# EAGLE design FLYTE-v2_1 (EAGLE 9.6.2)
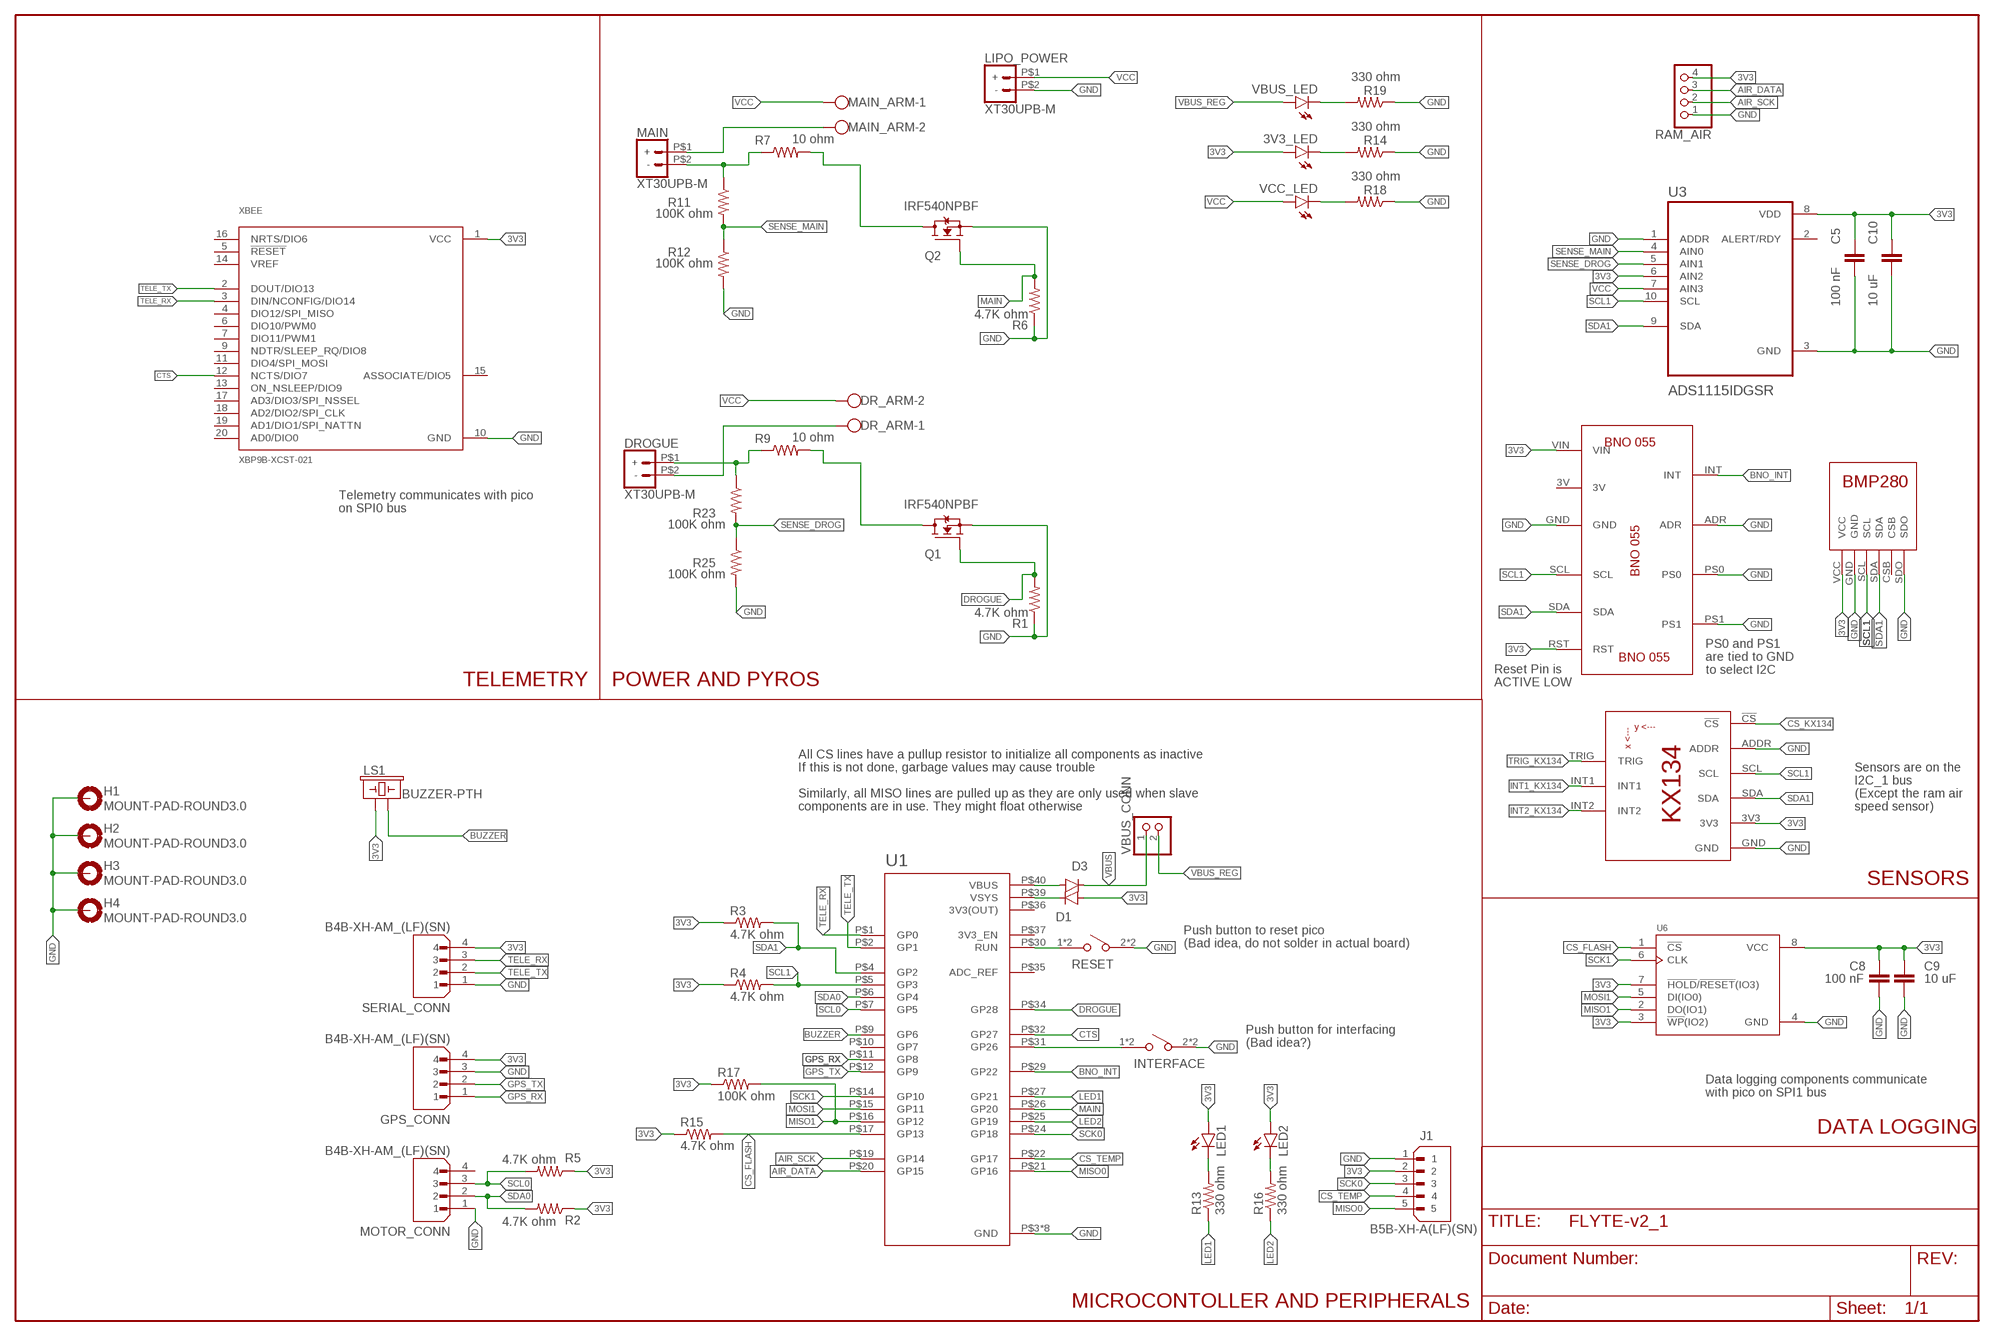
[diagram p0: schematic, sheet 1, part 1 of 2]
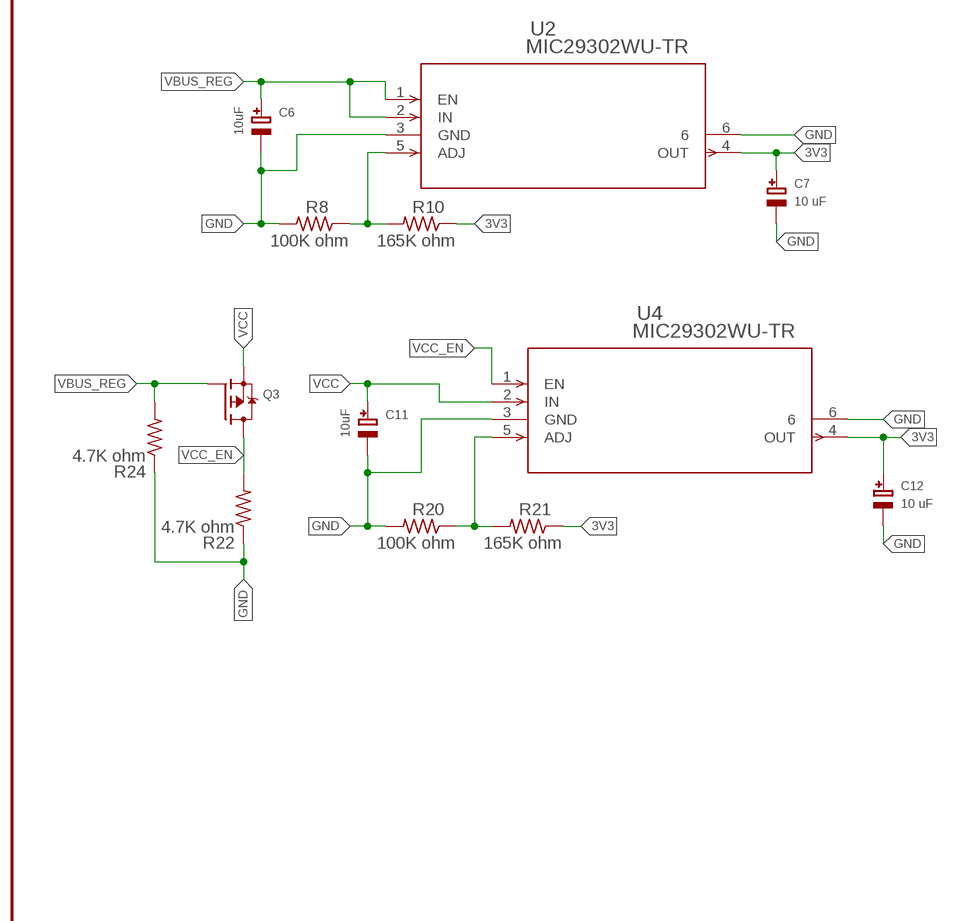
[diagram p1: schematic, sheet 1, part 2 of 2]

## Parts
3V3_LED  LEDCHIPLED_1206  [CHIPLED_1206]
C5  100 nF  22UF-0805-6.3V-20%  [0805]
C6  10uF  CAP_TANTALUMA/3216_WAVE  [EIA3216-18/A-W]
C7  10 uF  CAP_TANTALUMA/3216_WAVE  [EIA3216-18/A-W]
C8  100 nF  22UF-0805-6.3V-20%  [0805]
C9  10 uF  22UF-0805-6.3V-20%  [0805]
C10  10 uF  22UF-0805-6.3V-20%  [0805]
C11  10uF  CAP_TANTALUMA/3216_WAVE  [EIA3216-18/A-W]
C12  10 uF  CAP_TANTALUMA/3216_WAVE  [EIA3216-18/A-W]
D1  1N4004  [DO41-10]
D3  1N4004  [DO41-10]
DR_ARM  W237-102  [W237-102]
DROGUE  XT30UPB-M  [XT30UPB-M]
GPS_CONN  B4B-XH-AM_(LF)(SN)  [JST_B4B-XH-AM_(LF)(SN)]
H1  MOUNT-PAD-ROUND3.0  [3,0-PAD]
H2  MOUNT-PAD-ROUND3.0  [3,0-PAD]
H3  MOUNT-PAD-ROUND3.0  [3,0-PAD]
H4  MOUNT-PAD-ROUND3.0  [3,0-PAD]
INTERFACE  TS04-66-95-BK-100-SMT  [SW_TS04-66-95-BK-100-SMT]
J1  B5B-XH-A(LF)(SN)  [JST_B5B-XH-A(LF)(SN)]
LED1  LEDCHIPLED_1206  [CHIPLED_1206]
LED2  LEDCHIPLED_1206  [CHIPLED_1206]
LIPO_POWER  XT30UPB-M  [XT30UPB-M]
LS1  BUZZER-PTH  [BUZZER-12MM]
MAIN  XT30UPB-M  [XT30UPB-M]
MAIN_ARM  W237-102  [W237-102]
MOTOR_CONN  B4B-XH-AM_(LF)(SN)  [JST_B4B-XH-AM_(LF)(SN)]
Q1  IRF540NPBF  [TO254P1054X469X1930-3]
Q2  IRF540NPBF  [TO254P1054X469X1930-3]
Q3  MOSFET-PWIDE  [SOT23-WIDE]
R1  4.7K ohm  R-US_R0805  [R0805]
R2  4.7K ohm  R-US_R0805  [R0805]
R3  4.7K ohm  R-US_R0805  [R0805]
R4  4.7K ohm  R-US_R0805  [R0805]
R5  4.7K ohm  R-US_R0805  [R0805]
R6  4.7K ohm  R-US_R0805  [R0805]
R7  10 ohm  R-US_0207/10  [0207/10]
R8  100K ohm  R-US_R0805  [R0805]
R9  10 ohm  R-US_0207/10  [0207/10]
R10  165K ohm  R-US_R0805  [R0805]
R11  100K ohm  R-US_R0805  [R0805]
R12  100K ohm  R-US_R0805  [R0805]
R13  330 ohm  R-US_R0805  [R0805]
R14  330 ohm  R-US_R0805  [R0805]
R15  4.7K ohm  R-US_R0805  [R0805]
R16  330 ohm  R-US_R0805  [R0805]
R17  100K ohm  R-US_R0805  [R0805]
R18  330 ohm  R-US_R0805  [R0805]
R19  330 ohm  R-US_R0805  [R0805]
R20  100K ohm  R-US_R0805  [R0805]
R21  165K ohm  R-US_R0805  [R0805]
R22  4.7K ohm  R-US_R0805  [R0805]
R23  100K ohm  R-US_R0805  [R0805]
R24  4.7K ohm  R-US_R0805  [R0805]
R25  100K ohm  R-US_R0805  [R0805]
RAM_AIR  PINHD-1X4  [1X04]
RESET  TS04-66-95-BK-100-SMT  [SW_TS04-66-95-BK-100-SMT]
SERIAL_CONN  B4B-XH-AM_(LF)(SN)  [JST_B4B-XH-AM_(LF)(SN)]
U1  RASPBERRY_PICO-NO_DEBUG  [PICO-PKG-NO_DEBUG]
U2  MIC29302WU-TR  [TO-263-5_MCH]
U3  ADS1115IDGSR  [SOP50P490X110-10N]
U4  MIC29302WU-TR  [TO-263-5_MCH]
U6  W25Q32JVSSIQ  [SOIC127P790X216-8N]
U$1  BMP280  [BMP280]
U$2  KX134-BREAKOUT  [KX134-BREAKOUT]
U$4  BNO055  [BNO055]
VBUS_CONN  PINHD-1X2  [1X02]
VBUS_LED  LEDCHIPLED_1206  [CHIPLED_1206]
VCC_LED  LEDCHIPLED_1206  [CHIPLED_1206]
XBEE  XBP9B-XCST-021  [DIP2200W51P200L3294H279Q20P]

## Nets
3V3: 3V3_LED.A C5.1 C7.+ C8.2 C9.2 C10.1 C12.+ D1.A GPS_CONN.4 J1.2 LED1.A LED2.A LS1.+ R2.1 R3.1 R4.1 R5.1 R10.1 R15.1 R17.1 R21.1 RAM_AIR.4 SERIAL_CONN.4 U2.4(OUT) U3.6(AIN2) U3.8(VDD) U4.4(OUT) U6.3(!WP!(IO2)) U6.7(!HOLD!/!RESET!(IO3)) U6.8(VCC) U$1.VCC U$2.3V3 U$4.RST U$4.VIN XBEE.1(VCC)
AIR_DATA: RAM_AIR.3 U1.P$20(GP15)
AIR_SCK: RAM_AIR.2 U1.P$19(GP14)
BNO_INT: U1.P$29(GP22) U$4.INT
BUZZER: LS1.- U1.P$9(GP6)
CS_FLASH: R15.2 U1.P$17(GP13) U6.1(!CS)
CS_KX134: U$2.!CS
CS_TEMP: J1.4 U1.P$22(GP17)
CTS: U1.P$32(GP27) XBEE.12(NCTS/DIO7)
DROGUE: Q1.1(G) R1.2 U1.P$34(GP28)
GND: C5.2 C6.- C7.- C8.1 C9.1 C10.2 C11.- C12.- GPS_CONN.3 H1.B3,0(MOUNT) H2.B3,0(MOUNT) H3.B3,0(MOUNT) H4.B3,0(MOUNT) INTERFACE.2 INTERFACE.4 J1.1 LIPO_POWER.P$2(-) MOTOR_CONN.1 Q1.3(S) Q2.3(S) R1.1 R6.1 R8.2 R12.2 R14.1 R18.1 R19.1 R20.2 R22.1 R24.1 R25.2 RAM_AIR.1 RESET.2 RESET.4 SERIAL_CONN.1 U1.P$3(GND) U1.P$8(GND) U1.P$13(GND) U1.P$18(GND) U1.P$23(GND) U1.P$28(GND) U1.P$33(GND) U1.P$38(GND) U2.3(GND) U2.6 U3.1(ADDR) U3.3(GND) U4.3(GND) U4.6 U6.4(GND) U$1.GND U$1.SDO U$2.ADDR U$2.GND U$4.ADR U$4.GND U$4.PS0 U$4.PS1 XBEE.10(GND)
GPS_RX: GPS_CONN.1 U1.P$11(GP8)
GPS_TX: GPS_CONN.2 U1.P$12(GP9)
INT1_KX134: U$2.INT1
INT2_KX134: U$2.INT2
LED1: R13.1 U1.P$27(GP21)
LED2: R16.1 U1.P$25(GP19)
MAIN: Q2.1(G) R6.2 U1.P$26(GP20)
MISO0: J1.5 U1.P$21(GP16)
MISO1: R17.2 U1.P$16(GP12) U6.2(DO(IO1))
MOSI1: U1.P$15(GP11) U6.5(DI(IO0))
N$1: D1.C U1.P$39(VSYS)
N$2: DR_ARM.1 DROGUE.P$2(-)
N$3: INTERFACE.1 INTERFACE.3 U1.P$31(GP26)
N$4: MAIN.P$2(-) R7.1 R11.1
N$5: R20.1 R21.2 U4.5(ADJ)
N$6: MAIN.P$1(+) MAIN_ARM.2
N$7: DROGUE.P$1(+) R9.1 R23.1
N$8: RESET.1 RESET.3 U1.P$30(RUN)
N$10: R8.1 R10.2 U2.5(ADJ)
N$11: Q2.2(D) R7.2
N$12: Q1.2(D) R9.2
N$13: R19.2 VBUS_LED.C
N$14: LED1.C R13.2
N$15: LED2.C R16.2
N$16: 3V3_LED.C R14.2
N$17: D3.A U1.P$40(VBUS)
N$18: R18.2 VCC_LED.C
SCK0: J1.3 U1.P$24(GP18)
SCK1: U1.P$14(GP10) U6.6(CLK)
SCL0: MOTOR_CONN.3 R5.2 U1.P$7(GP5)
SCL1: R4.2 U1.P$5(GP3) U3.10(SCL) U$1.SCL U$2.SCL U$4.SCL
SDA0: MOTOR_CONN.2 R2.2 U1.P$6(GP4)
SDA1: R3.2 U1.P$4(GP2) U3.9(SDA) U$1.SDA U$2.SDA U$4.SDA
SENSE_DROG: R23.2 R25.1 U3.5(AIN1)
SENSE_MAIN: R11.2 R12.1 U3.4(AIN0)
TELE_RX: SERIAL_CONN.3 U1.P$1(GP0) XBEE.3(DIN/NCONFIG/DIO14)
TELE_TX: SERIAL_CONN.2 U1.P$2(GP1) XBEE.2(DOUT/DIO13)
TRIG_KX134: U$2.TRIG
VBUS: D3.C VBUS_CONN.1
VBUS_REG: C6.+ Q3.1(G) R24.2 U2.1(EN) U2.2(IN) VBUS_CONN.2 VBUS_LED.A
VCC: C11.+ DR_ARM.2 LIPO_POWER.P$1(+) MAIN_ARM.1 Q3.2(S) U3.7(AIN3) U4.2(IN) VCC_LED.A
VCC_EN: Q3.3(D) R22.2 U4.1(EN)
Unconnected: MOTOR_CONN.4 U1.P$10(GP7) U1.P$35(ADC_REF) U1.P$37(3V3_EN) U3.2(ALERT/RDY) U$1.CSB U$4.3V XBEE.4(DIO12/SPI_MISO) XBEE.5(!RESET) XBEE.6(DIO10/PWM0) XBEE.7(DIO11/PWM1) XBEE.9(NDTR/SLEEP_RQ/DIO8) XBEE.11(DIO4/SPI_MOSI) XBEE.13(ON_NSLEEP/DIO9) XBEE.14(VREF) XBEE.15(ASSOCIATE/DIO5) XBEE.16(NRTS/DIO6) XBEE.17(AD3/DIO3/SPI_NSSEL) XBEE.18(AD2/DIO2/SPI_CLK) XBEE.19(AD1/DIO1/SPI_NATTN) XBEE.20(AD0/DIO0)

## Notes on the sheet
- Telemetry communicates with pico 
  on SPI0 bus
- PS0 and PS1 
  are tied to GND
  to select I2C
- TELEMETRY | POWER AND PYROS
- Reset Pin is 
  ACTIVE LOW
- All CS lines have a pullup resistor to initialize all components as inactive
  If this is not done, garbage values may cause trouble
  
  Similarly, all MISO lines are pulled up as they are only used when slave
  components are in use. They might float otherwise
- Sensors are on the
  I2C_1 bus 
  (Except the ram air 
  speed sensor)
- SENSORS
- Push button to reset pico
  (Bad idea, do not solder in actual board)
- Push button for interfacing
  (Bad idea?)
- Data logging components communicate 
  with pico on SPI1 bus
- DATA LOGGING
- MICROCONTOLLER AND PERIPHERALS

## Power pins joined to a net without a drawn wire
3V3(OUT): U1.P$36(3V3(OUT))

## Library data of the parts
3V3_LED LED1 LED2 VBUS_LED VCC_LED = led:LED: LED OSRAM: - CHIPLED LG R971, LG N971, LY N971, LG Q971, LY Q971, LO R971, LY R971 LH N974, LH R974 LS Q976, LO Q976, LY Q976 LO Q996 - Hyper CHIPLED LW Q18S LB Q993, LB Q99A, LB R99A - SideLED LS A670, LO A670, LY A670, LG A670, LP A670 LB A673, LV A673, LT A673, LW A673 LH A674 LY A675 LS A676, LA A676, LO A676, LY A676, LW A676 LS A679, LY A679, LG A679 - Hyper Micro SIDELED® LS Y876, LA Y876, LO Y876, LY Y876 LT Y87S - SmartLED LW L88C, LW L88S LB L89C, LB L89S, LG L890 LS L89K, LO L89K, LY L89K LS L896, LA L896, LO L896, LY L896 - TOPLED LS T670, LO T670, LY T670, LG T670, LP T670 LSG T670, LSP T670, LSY T670, LOP T670, LYG T670 LG T671, LOG T671, LSG T671 LB T673, LV T673, LT T673, LW T673 LH T674 LS T676, LA T676, LO T676, LY T676, LB T676, LH T676, LSB T676, LW T676 LB T67C, LV T67C, LT T67C, LS T67K, LO T67K, LY T67K, LW E67C LS E67B, LA E67B, LO E67B, LY E67B, LB E67C, LV E67C, LT E67C LW T67C LS T679, LY T679, LG T679 LS T770, LO T770, LY T770, LG T770, LP T770 LB T773, LV T773, LT T773, LW T773 LH T774 LS E675, LA E675, LY E675, LS T675 LS T776, LA T776, LO T776, LY T776, LB T776 LHGB T686 LT T68C, LB T68C - Hyper Mini TOPLED® LB M676 - Mini TOPLED Santana® LG M470 LS M47K, LO M47K, LY M47K Source: http://www.osram.convergy.de LUXEON: - LUMILED® LXK2-PW12-R00, LXK2-PW12-S00, LXK2-PW14-U00, LXK2-PW14-V00 LXK2-PM12-R00, LXK2-PM12-S00, LXK2-PM14-U00 LXK2-PE12-Q00, LXK2-PE12-R00, LXK2-PE12-S00, LXK2-PE14-T00, LXK2-PE14-U00 LXK2-PB12-K00, LXK2-PB12-L00, LXK2-PB12-M00, LXK2-PB14-N00, LXK2-PB14-P00, LXK2-PB14-Q00 LXK2-PR12-L00, LXK2-PR12-M00, LXK2-PR14-Q00, LXK2-PR14-R00 LXK2-PD12-Q00, LXK2-PD12-R00, LXK2-PD12-S00 LXK2-PH12-R00, LXK2-PH12-S00 LXK2-PL12-P00, LXK2-PL12-Q00, LXK2-PL12-R00 Source: www.luxeon.com KINGBRIGHT: KA-3528ASYC Source: www.kingbright.com
C5 C8-C10 = SparkFun-Capacitors:22UF: 22µF ceramic capacitors A capacitor is a passive two-terminal electrical component used to store electrical energy temporarily in an electric field.; PROD_ID: CAP-08402; VALUE: 22uF
C6 C7 C11 C12 = microbuilder:CAP_TANTALUM: Tantalum Capacitors Wave footprints have larger pads and are meant to be used for hand soldering. Reflow footprints are optimised for solder paste and a reflow oven. EIA3216-18/A-[R/W] - Size A / 3216-18 / 1206 footprint 4.7µF 25V 10% Tantalum Capacitor 10µF 16V 10% Tantalum Capacitor [Digikey: 495-2236-2-ND] EIA3528-21/B-[R/W] - Size B / 3528-21 47µF 10V 10% Tantalum Capactior [Digikey: 495-2216-1-ND] EIA6032-28/C-[R/W] - Size C / 6032-28 10µF 35V 20% Tantalum Capacitor [Digikey: 495-2285-1-ND] 100µF 16V 10% Tantalum Capactior [Digikey: 399-5214-1-ND]
D1 D3 = diode:1N4004: DIODE general purpose rectifier, 1 A
DR_ARM MAIN_ARM = con-wago-500:W237-102: WAGO SCREW CLAMP; MPN: 237-102; OC_FARNELL: unknown; OC_NEWARK: 70K9898
DROGUE LIPO_POWER MAIN = XT30UPB-M:XT30UPB-M: Check availability <https://pricing.snapeda.com/parts/XT30UPB-M/amass/view-part?ref=eda>; AVAILABILITY: Not in stock; DESCRIPTION: Socket; DC supply; XT30; male; PIN: 2; on PCBs; THT; yellow; 15A; 500V; MF: amass; MP: XT30UPB-M; PACKAGE: None; PRICE: None
GPS_CONN MOTOR_CONN SERIAL_CONN = B4B-XH-AM__LF__SN_:B4B-XH-AM_(LF)(SN): Check availability <https://pricing.snapeda.com/parts/B4B-XH-AM%20%28LF%29%28SN%29/JST%20Corporation/view-part?ref=eda>; AVAILABILITY: In Stock; CHECK_PRICES: https://www.snapeda.com/parts/B4B-XH-AM%20(LF)(SN)/JST/view-part/?ref=eda; DESCRIPTION: Conn Shrouded Header HDR 4 POS 2.5mm Solder ST Top Entry Thru-Hole Box; MF: JST Corporation; MP: B4B-XH-AM (LF)(SN); PACKAGE: None; PRICE: None; SNAPEDA_LINK: https://www.snapeda.com/parts/B4B-XH-AM%20(LF)(SN)/JST/view-part/?ref=snap
H1-H4 = holes:MOUNT-PAD-ROUND: MOUNTING PAD, round
INTERFACE RESET = TS04-66-95-BK-100-SMT:TS04-66-95-BK-100-SMT: Check availability <https://pricing.snapeda.com/parts/TS04-66-95-BK-100-SMT/CUI%20Devices/view-part?ref=eda>; AVAILABILITY: In Stock; CHECK_PRICES: https://www.snapeda.com/parts/TS04-66-95-BK-100-SMT/CUI+Devices/view-part/?ref=eda; CUI_PURCHASE_URL: https://www.cuidevices.com/product/switches/tactile-switches/ts04-66-95-bk-100-smt?utm_source=snapeda.com&utm_medium=referral&utm_campaign=snapedaBOM; DESCRIPTION: 6 x 6 mm, 9.5 mm Actuator Height, 100 gf, Black, Surface Mount, SPST, Tactile Switch; MF: CUI Devices; MP: TS04-66-95-BK-100-SMT; PACKAGE: None; PRICE: None; SNAPEDA_LINK: https://www.snapeda.com/parts/TS04-66-95-BK-100-SMT/CUI+Devices/view-part/?ref=snap
J1 = B5B-XH-A_LF__SN_:B5B-XH-A(LF)(SN): Check availability <https://pricing.snapeda.com/parts/B5B-XH-A%28LF%29%28SN%29/JST%20Sales%20America%20Inc./view-part?ref=eda>; AVAILABILITY: In Stock; CHECK_PRICES: https://www.snapeda.com/parts/B5B-XH-A(LF)(SN)/JST+Sales+America+Inc./view-part/?ref=eda; DESCRIPTION: Connector Header Through Hole 5 position 0.098 (2.50mm); MF: JST Sales America Inc.; MP: B5B-XH-A(LF)(SN); PACKAGE: None; PRICE: None; SNAPEDA_LINK: https://www.snapeda.com/parts/B5B-XH-A(LF)(SN)/JST+Sales+America+Inc./view-part/?ref=snap
LS1 = SparkFun-Electromechanical:BUZZER: Buzzer Small round buzzers that operate around the audible 2kHz range. You can use these as speakers to create simple music or user interfaces. Variant Overview: PTH - Mini Speaker - PC Mount 12mm 2.048kHz <https://www.sparkfun.com/products/7950> PTH_KIT - Mini Speaker - PC Mount 12mm 2.048kHz <https://www.sparkfun.com/products/7950> KIT simplifies soldering by adding stop mask to one side of the pads. PTH_NO_SILK - Mini Speaker - PC Mount 12mm 2.048kHz <https://www.sparkfun.com/products/7950> No silkscreen indicator of buzzer outline. PTH_KIT_NO_SILK - Mini Speaker - PC Mount 12mm 2.048kHz <https://www.sparkfun.com/products/7950> KIT package w/o silkscreen SMD - Buzzer Audio Magnetic (CCV-084B16) SMD buzzer used on, e.g. the LilyPad Buzzer <https://www.sparkfun.com/products/8463> and RFID USB Reader <https://www.sparkfun.com/products/9963>. SMD_KIT - Buzzer Audio Magnetic (CCV-084B16) SMD Buzzer with elongated pins to make soldering easier. Used on the SparkFun Simon Says - Surface Mount Soldering Kit <https://www.sparkfun.com/products/10935>. SMD-SQUARE - Buzzer Audio Magnetic (COMP-15701) SMT square buzzer with one chamfered corner.; PROD_ID: COMP-08253; SF_SKU: COM-07950
Q1 Q2 = IRF540NPBF:IRF540NPBF: Check availability <https://pricing.snapeda.com/parts/IRF540NPBF/Infineon/view-part?ref=eda>; AVAILABILITY: In Stock; DESCRIPTION: RoHS Compliant | Low RDS(on) | Industry-leading quality | Dynamic dv/dt Rating | Fast Switching | Fully Avalanche Rated | 175C Operating Temperature; MF: Infineon; MP: IRF540NPBF; PACKAGE: TO-220 Infineon; PRICE: None; PURCHASE-URL: https://pricing.snapeda.com/search/part/IRF540NPBF/?ref=eda
Q3 = microbuilder:MOSFET-P: P-Channel Mosfet LEGEND VDS: Voltage Drain-Source ID: Drain Current RDS(ON): Drain-Source On-State Resistance VGS(TH): Gate-Source Threshold Voltage CISS: Drain-Source Input Capacitance SOT-23 Name VDS ID RDS(ON) VGS(TH) CISS Order Number IRLML5103 30V 760mA 600 mOhm -- 75pF @ 25V Digikey: IRLML5103PBFCT-ND IRLML6401 12V 4.3A 50 mOhm 950mV @ 250µA 830pF @ 10V Digikey: IRLML6401PBFTR-ND NTR0202PL 20V 400mA 800 mOhm 2.3V @ 250uA 70pF @ 5V Digikey: NTR0202PLT1GOSTR-ND NTR4101PT1G 20V 1.8A 85 mOhm 1.2V @ 250uA 675pF @ 10V Digikey: NTR4101PT1GOSCT-ND DMP2004K 20V 600mA 900 mOhm 1V @ 250uA 175pF @ 16V Digikey: DMP2004KDICT-ND PMV65XP 20V 3.9A 76 mOhm 950mV @ 1mA 725pF @ 20V Digikey: 568-2358-2-ND TO-252 Name VDS ID RDS(ON) VGS(TH) CISS Order Number AOD417 30V 25A 34 mOhm 3V @ 250µA 920pF @ 15V Digikey: 785-1106-2-ND
R1-R25 = rcl:R-US_: RESISTOR, American symbol; SPICEPREFIX: R
RAM_AIR = pinhead:PINHD-1X4: PIN HEADER
U1 = RpiPico:RASPBERRY_PICO-NO_DEBUG
U2 U4 = MIC29302WU:MIC29302WU-TR; COPYRIGHT: Copyright (C) 2024 Ultra Librarian. All rights reserved.; MANUFACTURER_PART_NUMBER: MIC29302WU-TR; MFR_NAME: Microchip
U3 = ADS1115IDGSR:ADS1115IDGSR: Check availability <https://pricing.snapeda.com/parts/ADS1115IDGSR/Texas%20Instruments/view-part?ref=eda>; AVAILABILITY: In Stock; CHECK_PRICES: https://www.snapeda.com/parts/ADS1115IDGSR/Texas+Instruments/view-part/?ref=eda; DESCRIPTION: 16-bit, 860-SPS, 4-channel, delta-sigma ADC with PGA, oscillator, VREF, comparator and I2C; MF: Texas Instruments; MP: ADS1115IDGSR; PACKAGE: VSSOP-10 Texas Instruments; PRICE: None; PURCHASE-URL: https://www.snapeda.com/api/url_track_click_mouser/?unipart_id=45903&manufacturer=Texas Instruments&part_name=ADS1115IDGSR&search_term=ads1115; SNAPEDA_LINK: https://www.snapeda.com/parts/ADS1115IDGSR/Texas+Instruments/view-part/?ref=snap
U6 = W25Q32JVSSIQ:W25Q32JVSSIQ: NOR Flash Serial-SPI 3V/3.3V 32M-bit 4M x 8 8.5ns 8-Pin SOIC Check availability <https://pricing.snapeda.com/parts/W25Q32JVSSIQ/Winbond/view-part?ref=eda>; AVAILABILITY: In Stock; DESCRIPTION: FLASH - NOR Memory IC 32Mb (4M x 8) SPI - Quad I/O 133 MHz 8-SOIC; MF: Winbond; MP: W25Q32JVSSIQ; PACKAGE: SOIC-8 Winbond; PRICE: None; PURCHASE-URL: https://pricing.snapeda.com/search/part/W25Q32JVSSIQ/?ref=eda
U$1 = BMP280:BMP280
U$2 = KX134_Breakout:KX134-BREAKOUT
U$4 = BNO055:BNO055
VBUS_CONN = pinhead:PINHD-1X2: PIN HEADER
XBEE = XBP9B-XCST-021:XBP9B-XCST-021: XBee-PRO 900HP DigiMesh 900 MHz 200 Kbps RF Module with U.FL Connector Check availability <https://pricing.snapeda.com/parts/XBP9B-XCST-021/Digi%20International/view-part?ref=eda>; AVAILABILITY: In Stock; CHECK_PRICES: https://www.snapeda.com/parts/XBP9B-XCST-021/Digi+International/view-part/?ref=eda; DESCRIPTION: General ISM < 1GHz - Transceiver Module 920MHz Antenna Not Included, RP-SMA Through Hole; MF: Digi International; MP: XBP9B-XCST-021; PACKAGE: Module Digi International; PRICE: None; PURCHASE-URL: https://www.snapeda.com/api/url_track_click_mouser/?unipart_id=521579&manufacturer=Digi International&part_name=XBP9B-XCST-021&search_term=None; SNAPEDA_LINK: https://www.snapeda.com/parts/XBP9B-XCST-021/Digi+International/view-part/?ref=snap

## Board
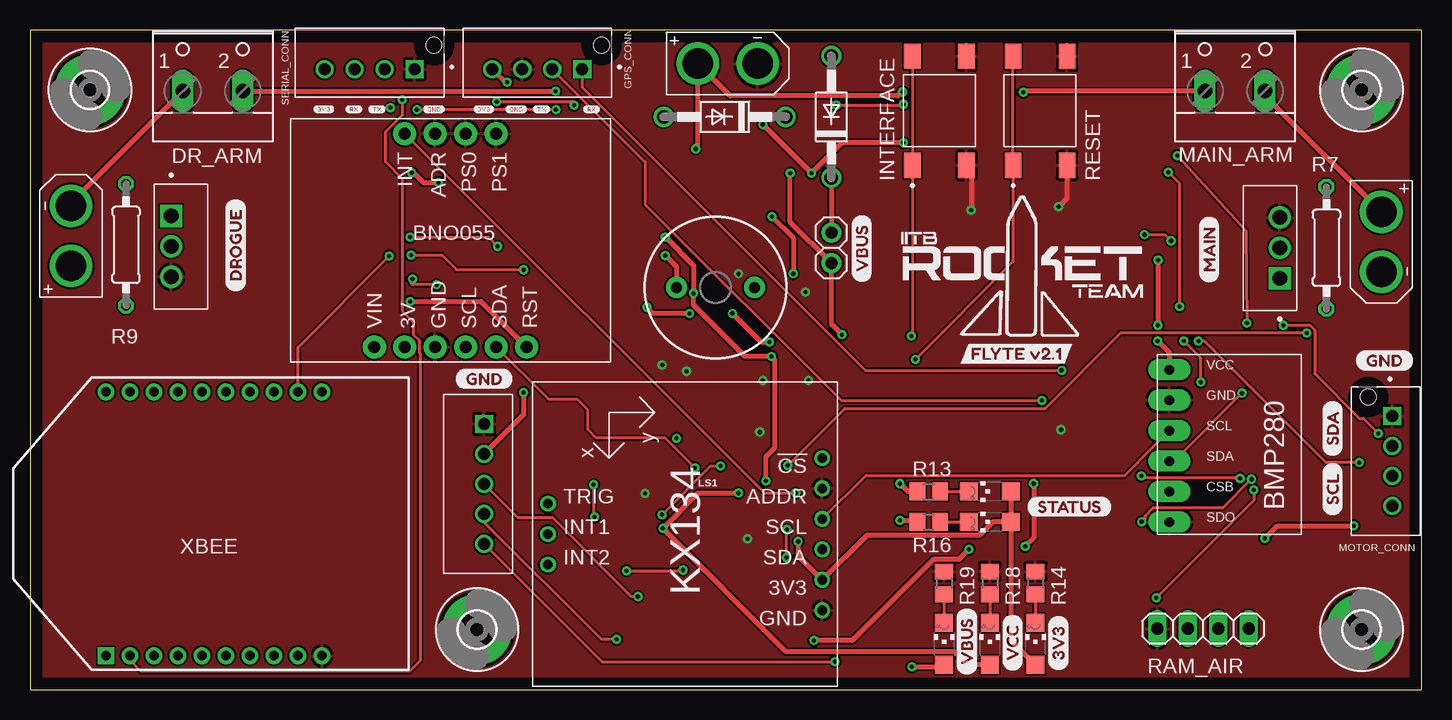
[diagram p2: board, top side]
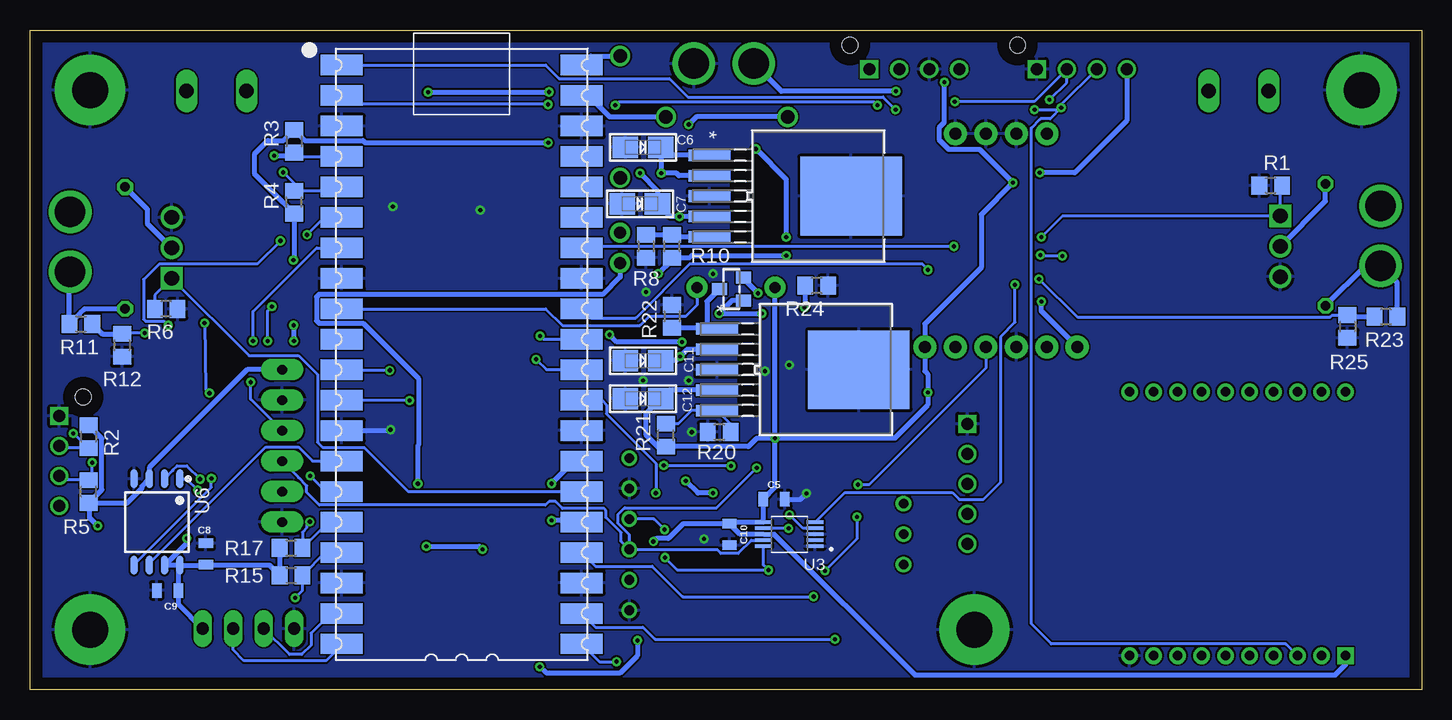
[diagram p3: board, bottom side, seen from below]

Size 116 x 55 mm. Coordinates in mm from the lower left corner, seen from the top.
Outline: 0,0 116,0 116,55 0,55 0,0
Copper layers (1*16): Top 0.035mm / dielectric 1.5mm / Bottom 0.035mm
Design rules "default": minimum track width 6mil, minimum drill 0.35mm, track to track 6mil, track to pad 6mil, pad to pad 6mil, via to via 6mil, smd to smd 6mil, copper to edge 40mil, drill to drill 6mil, minimum pad ring 10mil, minimum via ring 8mil, stop-mask expansion 4mil, vias tented up to drill 0mil, thermal gap 10mil

### Footprints (pad centres in the part's own frame; a part is rotated, then mirrored left to right if it is on the bottom)
CHIPLED_1206 = smd 1.5 x 1.5: A 0,-1.75; C 0,1.75
0805 = smd 0.8 x 1.2: 1 -0.9,0; 2 0.9,0
EIA3216-18/A-W = smd 2.15 x 1.8: + 1.475,0; - -1.475,0
DO41-10 = drill 1.118: A 5.08,0; C -5.08,0
W237-102 = drill 1.194 long: 1 -2.5,-1.27; 2 2.5,-1.27
XT30UPB-M = drill 2.54: P$1 -2.5,0; P$2 2.5,0
JST_B4B-XH-AM_(LF)(SN) = drill 1 square: 1 3.75,-0.525 | drill 1: 2 1.25,-0.525; 3 -1.25,-0.525; 4 -3.75,-0.525 | hole 1.3: 5.35,1.475
3,0-PAD = drill 3 pad 5.842: B3,0 0,0
SW_TS04-66-95-BK-100-SMT = smd 2.1 x 1.4: 1 -4.55,2.25; 2 -4.55,-2.25; 3 4.55,2.25; 4 4.55,-2.25
JST_B5B-XH-A(LF)(SN) = drill 1 square: 1 5,-0.525 | drill 1: 2 2.5,-0.525; 3 0,-0.525; 4 -2.5,-0.525; 5 -5,-0.525
BUZZER-12MM = drill 0.9 pad 1.778: + 3.25,0; - -3.25,0
TO254P1054X469X1930-3 = drill 1.23 square: 1 -2.54,-0.81 | drill 1.23: 2 0,-0.81; 3 2.54,-0.81
SOT23-WIDE = smd 1 x 1.27: 1 -0.95,-1; 2 0.95,-1; 3 0,1
R0805 = smd 1.3 x 1.5: 1 -0.95,0; 2 0.95,0
0207/10 = drill 0.813 octagon: 1 -5.08,0; 2 5.08,0
1X04 = drill 1.016 long: 1 -3.81,0; 2 -1.27,0; 3 1.27,0; 4 3.81,0
PICO-PKG-NO_DEBUG = smd 3.5 x 1.7: P$1 -8.73,25.4; P$2 -8.73,22.86; P$3 -8.73,20.32; P$4 -8.73,17.78; P$5 -8.73,15.24; P$6 -8.73,12.7; P$7 -8.73,10.16; P$8 -8.73,7.62; P$9 -8.73,5.08; P$10 -8.73,2.54; P$11 -8.73,0; P$12 -8.73,-2.54; P$13 -8.73,-5.08; P$14 -8.73,-7.62; P$15 -8.73,-10.16; P$16 -8.73,-12.7; P$17 -8.73,-15.24; P$18 -8.73,-17.78; P$19 -8.73,-20.32; P$20 -8.73,-22.86; P$21 11.27,-22.86; P$22 11.27,-20.32; P$23 11.27,-17.78; P$24 11.27,-15.24; P$25 11.27,-12.7; P$26 11.27,-10.16; P$27 11.27,-7.62; P$28 11.27,-5.08; P$29 11.27,-2.54; P$30 11.27,0; P$31 11.27,2.54; P$32 11.27,5.08; P$33 11.27,7.62; P$34 11.27,10.16; P$35 11.27,12.7; P$36 11.27,15.24; P$37 11.27,17.78; P$38 11.27,20.32; P$39 11.27,22.86; P$40 11.27,25.4
TO-263-5_MCH = smd 0.965 x 3.505: 1 -3.404,-9.055; 2 -1.702,-9.055; 3 0,-9.055; 4 1.702,-9.055; 5 3.404,-9.055 | smd 6.553 x 8.458: 6 0,2.743
SOP50P490X110-10N = smd 1.47 x 0.28: 1 -2.15,1; 2 -2.15,0.5; 3 -2.15,0; 4 -2.15,-0.5; 5 -2.15,-1; 6 2.15,-1; 7 2.15,-0.5; 8 2.15,0; 9 2.15,0.5; 10 2.15,1
SOIC127P790X216-8N = smd 1.6 x 0.6: 1 -3.6,1.905; 2 -3.6,0.635; 3 -3.6,-0.635; 4 -3.6,-1.905; 5 3.6,-1.905; 6 3.6,-0.635; 7 3.6,0.635; 8 3.6,1.905
BMP280 = drill 0.8 pad 1.778 long: CSB 11.43,1; GND 3.81,1; SCL 6.35,1; SDA 8.89,1; SDO 13.97,1; VCC 1.27,1
KX134-BREAKOUT = drill 0.8: 3V3 8.89,1.27; !CS 19.05,1.27; ADDR 16.51,1.27; GND 6.35,1.27; INT1 12.7,24.13; INT2 10.16,24.13; SCL 13.97,1.27; SDA 11.43,1.27; TRIG 15.24,24.13
BNO055 = drill 1 pad 1.93: 3V 9.525,1.27; ADR 12.065,19.05; GND 12.065,1.27; INT 9.525,19.05; PS0 14.605,19.05; PS1 17.145,19.05; RST 19.685,1.27; SCL 14.605,1.27; SDA 17.145,1.27; VIN 6.985,1.27
1X02 = drill 1.016 pad 1.676: 1 -1.27,0; 2 1.27,0
DIP2200W51P200L3294H279Q20P = drill 0.8 pad 1.4 square: 1 -11,8.75 | drill 0.8 pad 1.4: 2 -11,6.75; 3 -11,4.75; 4 -11,2.75; 5 -11,0.75; 6 -11,-1.25; 7 -11,-3.25; 8 -11,-5.25; 9 -11,-7.25; 10 -11,-9.25; 11 11,-9.25; 12 11,-7.25; 13 11,-5.25; 14 11,-3.25; 15 11,-1.25; 16 11,0.75; 17 11,2.75; 18 11,4.75; 19 11,6.75; 20 11,8.75

### Placement (x,y rotation side)
3V3_LED  83.82,3.81 0 top
C5  53.98,15.88 0 bottom
C6  64.9,45.21 0 bottom
C7  65.15,40.51 0 bottom
C8  101.35,11.3 270 bottom
C9  104.52,8.26 0 bottom
C10  57.68,12.93 270 bottom
C11  64.9,27.43 0 bottom
C12  64.9,24.26 0 bottom
D1  57.91,47.75 180 top
D3  66.8,47.75 90 top
DR_ARM  15.24,51.18 0 top
DROGUE  3.43,37.85 90 top
GPS_CONN  42.29,52.26 0 top
H1  5,50 0 top
H2  37.26,5 0 top
H3  111,50 0 top
H4  111,5 0 top
INTERFACE  75.82,48.26 90 top
J1  37.34,17.14 90 top
LED1  80.01,16.51 90 top
LED2  80.01,13.97 90 top
LIPO_POWER  58.17,52.2 0 top
LS1  57.15,33.53 180 top
MAIN  112.65,37.34 270 top
MAIN_ARM  100.46,51.18 0 top
MOTOR_CONN  113.03,19.05 90 top
Q1  12.57,36.96 270 top
Q2  103.38,36.83 90 top
Q3  57.53,33.4 90 bottom
R1  12.57,42.04 0 bottom
R2  111.12,21.08 270 bottom
R3  93.98,45.72 270 bottom
R4  93.98,40.64 90 bottom
R5  111.12,16.51 90 bottom
R6  104.65,31.75 180 bottom
R7  108.08,36.83 90 top
R8  64.64,36.96 270 bottom
R9  8,37.08 90 top
R10  62.48,36.96 90 bottom
R11  111.76,30.48 0 bottom
R12  108.33,28.7 270 bottom
R13  74.93,16.51 0 top
R14  83.82,8.89 270 top
R15  94.23,9.53 0 bottom
R16  74.93,13.97 0 top
R17  94.23,11.81 0 bottom
R18  80.01,8.89 270 top
R19  76.2,8.89 270 top
R20  58.55,21.46 180 bottom
R21  62.99,21.21 90 bottom
R22  62.48,31.11 270 bottom
R23  2.97,31.09 180 bottom
R24  50.42,33.68 180 bottom
R25  6.17,30.28 270 bottom
RAM_AIR  97.79,5.08 0 top
RESET  84.2,48.26 90 top
SERIAL_CONN  28.32,52.26 0 top
U1  81.28,26.67 0 bottom
U2  50.29,41.15 270 bottom
U3  52.7,12.95 180 bottom
U4  49.66,26.67 270 bottom
U6  105.41,13.97 270 bottom
U$1  93.98,27.94 270 top
U$2  67.31,0.25 90 top
U$3  [GND0]  35.43,25.91 0 top
U$4  21.72,27.3 0 top
U$5  [3V30]  85.72,1.52 90 top
U$9  [STATUS0]  83.06,15.24 0 top
U$10  [VCC0]  81.92,1.52 90 top
U$11  [VBUS0]  78.11,1.14 90 top
U$12  [MAIN0]  98.3,33.91 90 top
U$13  [DROGUE0]  17.14,33.15 90 top
U$15  [GND0]  110.49,27.43 0 top
U$16  [SCL0]  108.58,14.48 90 top
U$17  [SDA0]  108.58,19.43 90 top
U$18  [GND0]  39.62,48.39 0 top
U$19  [3V30]  36.96,48.39 0 top
U$20  [3V30]  23.62,48.39 0 top
U$21  [GND0]  32.77,48.39 0 top
U$22  [RX0]  26.29,48.39 0 top
U$23  [RX0]  46.1,48.39 0 top
U$24  [TX0]  28.19,48.39 0 top
U$25  [TX0]  41.91,48.39 0 top
U$26  [VBUS0]  69.34,33.91 90 top
U$27  [FLYTE_V2#10]  77.53,28 0 top
VBUS_CONN  66.8,36.83 270 top
VBUS_LED  76.2,3.81 0 top
VCC_LED  80.01,3.81 0 top
XBEE  15.09,13.82 90 top

### Tracks (layer width: path | path; a pad name or v marks a point on that pad's centre or on a via)
3V3  (via drill 0.35)
  Top 0.406: LED2.A 81.76,4.12 3V3_LED.A | LED1.A LED2.A | LED2.A 80.26,13.97 79.16,12.86 69.76,12.86 U$2.3V3 64.03,11.15 v64.03,12.34 | v94.04,35.82 v94.04,30.38 v94.03,30.38 | v94,29.06 94.98,28.09 U$1.VCC | GPS_CONN.4 39.63,50.65 v39.78,50.65 | v31.83,43.1 32,42.93 32.15,42.93 32.81,42.27 v34.06,42.27 | v102.95,12.6 103.99,13.64 v110.36,13.64 | v31.7,32.36 37.62,32.36 U$4.RST | v41.15,24.77 41.15,22.93 J1.2 | v72.8,45.59 67.69,45.59 v65.15,43.05 v61.09,47.12 | v52.96,36.2 53.9,35.25 LS1.+ | v61.85,39.45 63.63,37.67 v63.63,34.67
  Bottom 0.406: C10.1 57.56,13.95 U3.6 54.88,13.97 C5.1 53.9,16.85 v53.9,20.95 | v53.9,20.95 LS1.+ | C10.1 56.81,12.95 U3.8 53.98,12.95 42.24,1.22 7.17,1.22 6.34,2.06 XBEE.1 | RAM_AIR.4 103.62,7.1 C9.2 103.62,10.25 U6.8 | U6.8 U6.7 102.95,12.2 v102.95,12.6 | U6.8 101.38,10.37 | 101.38,10.37 C8.2 | 111.02,15.56 R5.1 110.23,16.45 110.02,16.66 110.02,20.93 110.23,21.14 R2.1 | 111.02,15.56 107.9,15.56 106.66,16.8 106.66,16.96 U6.3 106.05,18.52 97.89,26.67 U$1.VCC | R17.1 R15.1 96.03,10.37 101.38,10.37 | v94.04,35.82 93.98,35.88 R4.1 94.87,40.58 94.88,40.58 97.26,42.96 97.26,44.69 96.17,45.78 94.87,45.78 R3.1 93.09,45.78 88.23,45.78 88.05,45.59 v72.8,45.59 | v94.03,30.38 94.03,29.09 v94,29.06 | SERIAL_CONN.4 24.57,47.44 28.91,43.1 v31.83,43.1 | v39.78,50.65 39.78,47.31 40.18,46.9 40.18,45.81 39.41,45.03 36.83,45.03 v34.06,42.27 36.7,39.62 36.7,35.18 41.4,30.48 U$4.RST 41.4,26.54 41.15,26.29 v41.15,24.77 41.15,23.75 43.94,20.95 v53.9,20.95 | v64.03,12.34 63.77,12.6 62.79,12.6 61.56,13.83 C10.1 | v110.36,13.64 111.02,14.3 111.02,15.56 | U$4.VIN 31.7,31.57 v31.7,32.36 | U4.4 62.71,24.97 C12.+ 64.64,23.04 64.64,21.21 63.69,20.26 R21.1 56.12,20.26 55.42,20.95 v53.9,20.95 | U2.4 v61.85,39.45 62.61,39.45 C7.+ 63.68,41.58 v65.15,43.05 | D1.A 60.45,47.75 v61.09,47.12 | v52.96,36.2 60.83,36.2 61.02,36.01 R10.1 62.48,35.81 v63.63,34.67
AIR_DATA
  Bottom 0.254: U1.P$20 90.01,3.72 91.31,2.41 98.17,2.41 99.06,3.3 RAM_AIR.3
AIR_SCK
  Bottom 0.254: U1.P$19 90.93,6.35 92.58,4.7 92.58,3.68 93.34,2.92 94.36,2.92 RAM_AIR.2
BNO_INT  (via drill 0.35)
  Top 0.254: U$4.INT 61.21,16.38 v63.83,16.38
  Bottom 0.254: U1.P$29 68.33,24.13 67.94,23.75 67.94,22.99 63.83,18.87 v63.83,16.38
BUZZER
  Bottom 0.254: U1.P$9 73,31.75 71.62,30.37 65.15,30.37 64.4,31.11 61.34,31.11 60.4,32.06 LS1.-
CS_FLASH  (via drill 0.35)
  Top 0.254: v102.03,16.64 102.03,15.77 v93.9,7.64
  Bottom 0.254: U1.P$17 91.38,11.43 R15.2 93.28,8.27 v93.9,7.64 | U6.1 102.97,17.57 v102.03,16.64
CS_TEMP  (via drill 0.35)
  Top 0.254: v48.9,4.19 47.62,4.19 37.86,13.95 J1.4
  Bottom 0.254: U1.P$22 68.87,5.21 64.9,5.21 63.88,4.19 v48.9,4.19
CTS  (via drill 0.35)
  Top 0.254: XBEE.12 22.34,28.54 v29.95,36.14 | v31.77,36.22 34.34,36.22 35.56,35 v41.15,35
  Bottom 0.254: v29.95,36.14 31.7,36.14 v31.77,36.22 | U1.P$32 69.25,30.99 65.48,30.99 60.96,35.51 41.66,35.51 v41.15,35
DROGUE  (via drill 0.35)
  Top 0.254: v38.99,36.96 38.23,37.72 v31.7,37.72
  Bottom 0.254: R1.2 11.76,41.9 Q1.1 29.92,39.5 v31.7,37.72 | U1.P$34 69.88,36.96 v38.99,36.96
GND  (via drill 0.35)
  Top 0.406: RESET.2 86.45,40.96 v85.75,40.26 | INTERFACE.2 78.46,43.32 v78.46,39.98
  Bottom 0.406: U1.P$13 86.03,21.59 v85.95,21.67 | C5.2 51.77,15.88 v51.28,16.36
  other vias: 59.05,34.67 64.64,33.15 54.74,26.54 52.7,27.05 59.82,12.57 60.83,21.46 64.9,25.78 61.09,25.78
  pour Top: -0.03,55.02 -0.03,-0.03 116.03,-0.03 116.03,54.99 116,55.02
  pour Bottom: -0.03,55.04 -0.03,-0.03 116,-0.03 116.03,0 116.03,55.02 116,55.04
GPS_RX  (via drill 0.35)
  Top 0.254: GPS_CONN.1 46.04,50.21 69.63,26.62 v86,26.62
  Bottom 0.254: v86,26.62 89.96,26.62 U1.P$11
GPS_TX  (via drill 0.35)
  Top 0.254: GPS_CONN.2 51.28,43.99 51.28,40.46 67.63,24.11 v84.35,24.11
  Bottom 0.254: v84.35,24.11 89.98,24.11 U1.P$12
LED1  (via drill 0.35)
  Top 0.406: v72.52,17.17 73.17,16.51 R13.1
  Bottom 0.406: U1.P$27 70.64,19.05 v72.52,17.17
LED2  (via drill 0.35)
  Top 0.406: v72.52,14.1 73.85,14.1 R16.1
  Bottom 0.406: U1.P$25 70.14,14.1 v72.52,14.1
MAIN
  Bottom 0.254: U1.P$26 84.47,16.51 88.14,20.18 91.59,20.18 92.04,20.62 92.04,26.27 93.61,27.84 97.74,27.84 Q2.1 105.6,32.88 R6.2
MISO0  (via drill 0.35)
  Top 0.254: J1.5 47.68,2.33 v67.1,2.33
  Bottom 0.254: U1.P$21 68.53,2.33 v67.1,2.33
MISO1  (via drill 0.35)
  Top 0.254: v92.67,13.99 92.92,14.25 92.92,14.45 93.61,15.14 99.42,15.14 v101.83,17.54
  Bottom 0.254: U1.P$16 91.12,13.97 R17.2 93.28,13.12 92.92,13.49 92.92,13.74 v92.67,13.99 | U6.2 104.08,18.26 104.08,18.31 103.75,18.65 102.93,18.65 v101.83,17.54
MOSI1  (via drill 0.35)
  Top 0.254: v92.63,17.8 92.76,17.68 100.81,17.68 v100.88,17.61
  Bottom 0.254: U6.5 107.31,10.42 100.88,16.86 v100.88,17.61 | v92.63,17.8 91.34,16.51 U1.P$15
N$1
  Bottom 0.406: U1.P$39 69.45,49.53 67.67,47.75 D1.C
N$2
  Top 0.406: DR_ARM.1 3.43,40.6 DROGUE.P$2
N$3  (via drill 0.35)
  Top 0.254: INTERFACE.3 INTERFACE.1 73.57,29.58 v73.48,29.49
  Bottom 0.254: v73.48,29.49 73.2,29.21 U1.P$31
N$4
  Bottom 0.406: R7.1 111.44,31.75 111.82,31.38 111.82,31.37 R11.1 112.71,34.78 MAIN.P$2
N$5
  Bottom 0.254: R20.1 57.6,22.15 U4.5 60.87,23.27 61.98,22.16 R21.2
N$6
  Top 0.406: MAIN.P$1 102.96,49.53 MAIN_ARM.2
N$7
  Bottom 0.406: R23.1 2.02,33.94 DROGUE.P$1 4.66,35.35 R9.1
N$8  (via drill 0.35)
  Top 0.254: RESET.3 RESET.1 81.95,35.67 v73.81,27.53
  Bottom 0.254: v73.81,27.53 72.95,26.67 U1.P$30
N$10
  Bottom 0.406: U2.5 62.32,37.74 R10.2 R8.1
N$11
  Bottom 0.406: R7.2 106.23,40.06 106.23,38.87 Q2.2
N$12
  Bottom 0.406: Q1.2 8,40.72 R9.2
N$13
  Top 0.254: R19.2 VBUS_LED.C
N$14
  Top 0.254: R13.2 LED1.C
N$15
  Top 0.254: R16.2 LED2.C
N$16
  Top 0.254: R14.2 3V3_LED.C
N$17
  Bottom 0.406: U1.P$40 69.25,52.83 D3.A
N$18
  Top 0.254: R18.2 VCC_LED.C
SCK0  (via drill 0.35)
  Top 0.254: J1.3 40.66,14.35 43.56,14.35 50.16,7.75 v50.67,7.75
  Bottom 0.254: U1.P$24 68.87,10.29 64.14,10.29 61.59,7.75 v50.67,7.75
SCK1
  Bottom 0.254: U6.6 106.05,10.53 96.35,20.22 93.61,20.22 92.44,19.05 U1.P$14
SCL0  (via drill 0.35)
  Top 0.254: v110.82,18.92 108.03,18.92 97.89,29.06 v97.41,29.06
  Bottom 0.254: MOTOR_CONN.3 113.22,17.46 R5.2 110.82,17.77 v110.82,18.92 | v97.41,29.06 97.41,31.52 92.1,36.83 U1.P$7
SCL1  (via drill 0.35)
  Top 0.254: U$1.SCL 93.61,20.22 91.22,17.83 69.65,17.83 U$2.SCL | v97.61,25.63 97.61,27.64 v96.19,29.06 | v95.83,31.93 95.83,42.19 v94.89,43.13 | v46.99,17.09 46.99,14.47 v47.06,14.4 | v49.73,9.91 54.38,9.91 v54.43,9.96 | v63.07,11 63.07,13.31 v63.09,13.34
  Bottom 0.254: U1.P$5 90.33,41.59 R4.2 93.98,42.22 v94.89,43.13 | U$1.SCL 96.35,22.96 97.61,24.22 v97.61,25.63 | v96.19,29.06 96.19,31.57 v95.83,31.93 | v47.06,14.4 47.06,12.58 v49.73,9.91 | U3.10 54.85,10.38 v54.43,9.96 62.03,9.96 v63.07,11 | v63.09,13.34 63.98,14.22 U$2.SCL | v46.99,17.09 46.03,17.09 36.32,26.8 U$4.SCL
SDA0  (via drill 0.35)
  Top 0.254: v92.91,37.92 94.61,37.92 v95.12,37.41 | v112.41,21.36 111.16,22.61 110.81,22.61 107.08,26.34 107.08,29.99 106.7,30.38 v104.47,30.38
  Bottom 0.254: MOTOR_CONN.2 113.39,20.13 R2.2 112.35,21.36 v112.41,21.36 | U1.P$6 91.47,39.37 v92.91,37.92 | v95.12,37.41 97.05,35.49 105.23,35.49 106.53,34.19 106.53,30.88 106.36,30.72 104.81,30.72 v104.47,30.38
SDA1  (via drill 0.35)
  Top 0.254: v95.64,44.53 101.35,38.27 v101.45,30.56 | v101.04,24.71 95.38,19.05 U$1.SDA | v55.42,18.49 52.92,20.99 47.21,20.99 46.48,21.72 46.48,23.34 45.6,24.22 43.21,24.22 U$4.SDA
  Bottom 0.254: U3.9 55.86,12.45 56.97,11.35 58.4,11.35 58.73,11.68 U$2.SDA | U$1.SDA 93.61,17.68 92.92,16.99 92.92,16.43 91.88,15.38 73.03,15.38 72.74,15.67 72.19,15.67 71.62,15.1 68.14,15.1 67.98,14.94 67.98,14.35 66.73,13.1 66.73,12.37 U$2.SDA | U1.P$4 93.66,44.45 R3.2 94.09,44.66 | v101.45,30.56 101.35,25.02 v101.04,24.71 | v55.42,18.49 58.76,15.16 66.43,15.16 66.97,14.61 66.97,13.84 66.04,12.9 U$2.SDA
  Bottom 0.406: v95.64,44.53 94.22,44.53 94.09,44.66
SENSE_DROG  (via drill 0.35)
  Top 0.254: v33.88,33.76 31.88,33.76 31.77,33.86 31.77,34.13 v31.88,34.24
  Bottom 0.254: v33.88,33.76 33.88,30.62 35.08,29.43 35.08,17.3 36.53,15.85 38.53,15.85 39.11,16.43 48.08,16.43 U3.5 | R25.1 7.45,31.23 7.61,31.06 28.7,31.06 v31.88,34.24
  Bottom 0.406: R25.1 6.04,31.09 R23.2
SENSE_MAIN  (via drill 0.35)
  Top 0.254: v52.68,14.58 56.74,18.64 v57.56,18.64 | v63.17,18.69 67.92,23.45 84.63,23.45 90.9,29.72 v106.43,29.72
  Bottom 0.254: U3.4 51.55,13.45 v52.68,14.58 | v57.56,18.64 57.61,18.69 v63.17,18.69 | v106.43,29.72 108.27,29.72 R12.1
  Bottom 0.406: R11.2 109.98,29.65 R12.1
TELE_RX  (via drill 0.35)
  Top 0.254: v43.84,48.36 v32.26,48.36
  Bottom 0.254: SERIAL_CONN.3 30.04,48.76 v30.04,48.51 | v30.04,48.51 30.95,47.6 31.76,47.6 32.54,46.82 32.54,5.49 30.86,3.81 11.33,3.81 XBEE.3 | v43.84,48.36 44.88,49.4 61.16,49.4 62.7,50.94 71.88,50.94 73,52.07 U1.P$1 | v32.26,48.36 30.19,48.36 v30.04,48.51
TELE_TX  (via drill 0.35)
  Top 0.254: XBEE.2 8.34,2.44 9.25,1.53 31.65,1.53 32.54,2.41 32.54,28.01 32.49,28.06 32.49,29.09 31.95,29.62 31.95,30.66 31.04,31.57 31.04,42.62 29.64,44.02 29.64,46.52 31.06,47.94 31.06,49.28 31.01,49.23 v31.01,49.18 | v38.91,49.02 45.26,49.02 45.39,48.9 45.39,48.77 v45.36,48.73 | v67.21,48.72 72.75,48.72 v72.82,48.79
  Bottom 0.254: v31.01,49.18 29.57,50.62 SERIAL_CONN.2 32.28,49.02 v38.91,49.02 | v45.36,48.73 45.61,48.99 66.94,48.99 v67.21,48.72 | v72.82,48.79 89.27,48.79 U1.P$2
VBUS
  Top 0.406: D3.C VBUS_CONN.1
VBUS_REG  (via drill 0.35)
  Top 0.406: v83.67,17.17 83.67,12.65 v82.96,11.94 | v78.28,11.68 77.44,10.85 75.3,10.85 68.55,4.09 v65.35,4.09 | v73.51,1.91 76.05,1.91 VBUS_LED.A | v63.37,43.05 63.37,38.99 VBUS_CONN.2 66.8,30.48 v67.69,29.59 | v58.55,31.37 60.93,28.98 v61.64,28.98 | v54.98,31.36 51.95,31.36 v51.44,31.88
  Bottom 0.406: VBUS_CONN.2 66.8,34.4 68.24,32.96 91.91,32.96 92.12,32.75 92.12,30.75 91.91,30.54 88.24,30.54 83.62,25.92 83.62,20.39 83.67,20.34 v83.67,17.17 | v82.96,11.94 78.54,11.94 v78.28,11.68 | v65.35,4.09 65.35,2.82 66.78,1.4 73,1.4 v73.51,1.91 | U2.1 62.76,44.55 C6.+ 63.37,45.16 v63.37,43.05 62.1,43.05 61.9,42.85 U2.2 | Q3.1 57.47,32.45 v58.55,31.37 v54.99,31.37 v54.98,31.36 | v61.64,28.98 67.08,28.98 v67.69,29.59 | v51.44,31.88 51.37,31.94 R24.2
VCC  (via drill 0.35)
  Top 0.406: VCC_LED.A 78.2,2.06 77.1,3.17 63.03,3.17 v52.76,13.44 55.7,16.38 v59.05,16.38 | MAIN_ARM.1 82.91,49.91 v82.8,49.81 | v72.72,49.84 72.39,49.51 58.36,49.51 LIPO_POWER.P$1 55.67,45.25 v55.5,45.09 | DR_ARM.2 43.79,49.91 v43.81,49.89 | v52.96,37.72 55.32,35.36 v55.32,33.05 55.32,32.05 59.6,27.77 v61.81,27.77 62.06,27.52 62.06,20.15 61.34,19.43 v61.34,17.4
  Bottom 0.254: 52.77,13.45 U3.7
  Bottom 0.406: 52.77,13.45 v52.76,13.44 | v82.8,49.81 72.75,49.81 v72.72,49.84 | v43.81,49.89 53.35,49.89 LIPO_POWER.P$1 | U4.2 61.21,28.37 v61.81,27.77 62.15,27.43 C11.+ | Q3.2 56.53,34.26 v55.32,33.05 | v55.5,45.09 52.96,42.55 v52.96,37.72 | v59.05,16.38 60.33,16.38 v61.34,17.4
VCC_EN
  Bottom 0.406: U4.1 58.8,30.16 59.56,30.16 | 59.56,30.16 R22.2 | Q3.3 59.56,32.37 59.56,30.16